# Altium schematic sheet FPGAPowerSupply.SchDoc
size A4
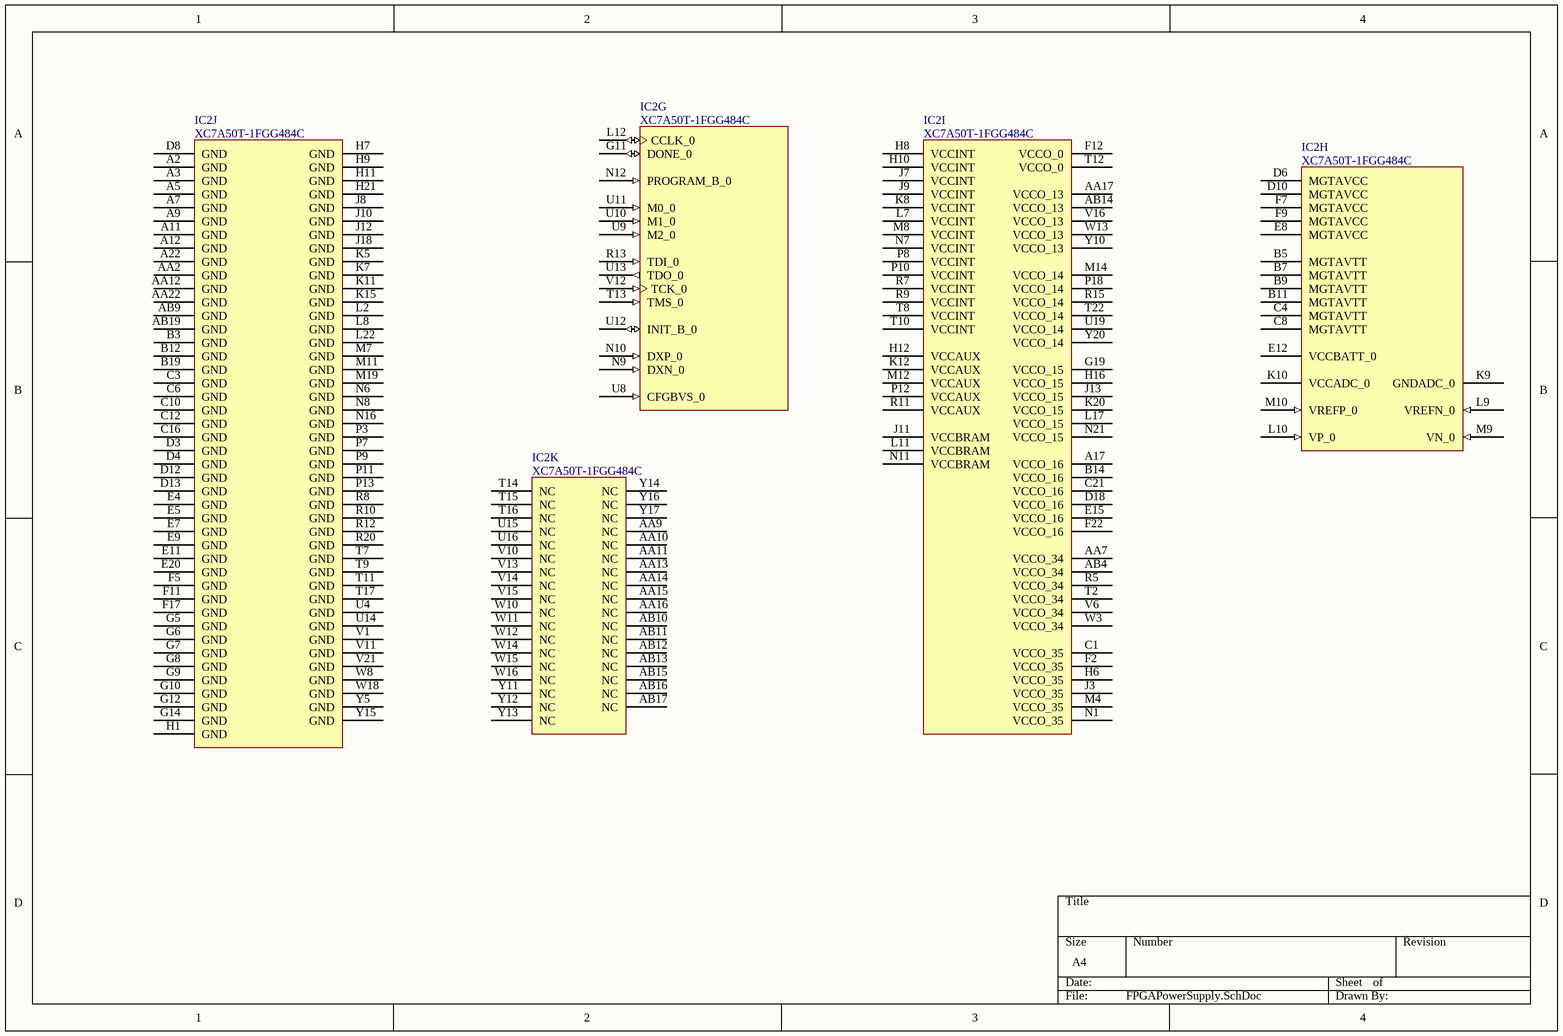
[diagram p0: FPGAPowerSupply.SchDoc]

## Parts
IC2  XC7A50T-1FGG484C  [BGA484C100P22X22_2300X2300X260]  (parts G,H,I,J,K of 11)

## Nets

Not connected (* = marked no-connect by the designer): IC2 A2(GND) A3(GND) A5(GND) A7(GND) A9(GND) A11(GND) A12(GND) A17(VCCO_16) A22(GND) AA2(GND) AA7(VCCO_34) AA9(NC) AA10(NC) AA11(NC) AA12(GND) AA13(NC) AA14(NC) AA15(NC) AA16(NC) AA17(VCCO_13) AA22(GND) AB4(VCCO_34) AB9(GND) AB10(NC) AB11(NC) AB12(NC) AB13(NC) AB14(VCCO_13) AB15(NC) AB16(NC) AB17(NC) AB19(GND) B3(GND) B5(MGTAVTT) B7(MGTAVTT) B9(MGTAVTT) B11(MGTAVTT) B12(GND) B14(VCCO_16) B19(GND) C1(VCCO_35) C3(GND) C4(MGTAVTT) C6(GND) C8(MGTAVTT) C10(GND) C12(GND) C16(GND) C21(VCCO_16) D3(GND) D4(GND) D6(MGTAVCC) D8(GND) D10(MGTAVCC) D12(GND) D13(GND) D18(VCCO_16) E4(GND) E5(GND) E7(GND) E8(MGTAVCC) E9(GND) E11(GND) E12(VCCBATT_0) E15(VCCO_16) E20(GND) F2(VCCO_35) F5(GND) F7(MGTAVCC) F9(MGTAVCC) F11(GND) F12(VCCO_0) F17(GND) F22(VCCO_16) G5(GND) G6(GND) G7(GND) G8(GND) G9(GND) G10(GND) G11(DONE_0) G12(GND) G14(GND) G19(VCCO_15) H1(GND) H6(VCCO_35) H7(GND) H8(VCCINT) H9(GND) H10(VCCINT) H11(GND) H12(VCCAUX) H16(VCCO_15) H21(GND) J3(VCCO_35) J7(VCCINT) J8(GND) J9(VCCINT) J10(GND) J11(VCCBRAM) J12(GND) J13(VCCO_15) J18(GND) K5(GND) K7(GND) K8(VCCINT) K9(GNDADC_0) K10(VCCADC_0) K11(GND) K12(VCCAUX) K15(GND) K20(VCCO_15) L2(GND) L7(VCCINT) L8(GND) L9(VREFN_0) L10(VP_0) L11(VCCBRAM) L12(CCLK_0) L17(VCCO_15) L22(GND) M4(VCCO_35) M7(GND) M8(VCCINT) M9(VN_0) M10(VREFP_0) M11(GND) M12(VCCAUX) M14(VCCO_14) M19(GND) N1(VCCO_35) N6(GND) N7(VCCINT) N8(GND) N9(DXN_0) N10(DXP_0) N11(VCCBRAM) N12(PROGRAM_B_0) N16(GND) N21(VCCO_15) P3(GND) P7(GND) P8(VCCINT) P9(GND) P10(VCCINT) P11(GND) P12(VCCAUX) P13(GND) P18(VCCO_14) R5(VCCO_34) R7(VCCINT) R8(GND) R9(VCCINT) R10(GND) R11(VCCAUX) R12(GND) R13(TDI_0) R15(VCCO_14) R20(GND) T2(VCCO_34) T7(GND) T8(VCCINT) T9(GND) T10(VCCINT) T11(GND) T12(VCCO_0) T13(TMS_0) T14(NC) T15(NC) T16(NC) T17(GND) T22(VCCO_14) U4(GND) U8(CFGBVS_0) U9(M2_0) U10(M1_0) U11(M0_0) U12(INIT_B_0) U13(TDO_0) U14(GND) U15(NC) U16(NC) U19(VCCO_14) V1(GND) V6(VCCO_34) V10(NC) V11(GND) V12(TCK_0) V13(NC) V14(NC) V15(NC) V16(VCCO_13) V21(GND) W3(VCCO_34) W8(GND) W10(NC) W11(NC) W12(NC) W13(VCCO_13) W14(NC) W15(NC) W16(NC) W18(GND) Y5(GND) Y10(VCCO_13) Y11(NC) Y12(NC) Y13(NC) Y14(NC) Y15(GND) Y16(NC) Y17(NC) Y20(VCCO_14)

## Library data of the parts
IC2 = XC7A50T-1FGG484C: Artix-7 FPGA, 4 GTPs, 250 User I/Os, 484-Ball Fine-Pitch Thin BGA (1.0mm Pitch), Speed Grade 1, Commercial Grade, Pb-Free; Manufacturer: XILINX; PressFit: No; Bonding: No; Part Number: XC7A50T-1FGG484C; Component Kind: Standard; Component Type: Standard; Device: XC7A50T-1FGG484C; PackageDescription: BGA, 1.00mm Pitch, Square; 484 Pin, 22 Columns x 22 Rows, Body 23mm X 23mm X 2.60mm H, IPC Medium Density; Part Description: Artix-7 FPGA, 4 GTPs, 250 User I/Os, 484-Ball Fine-Pitch Thin BGA (1.0mm Pitch), Speed Grade 1, Commercial Grade, Pb-Free; Manufacturer Part Number: XC7A50T-1FGG484C; Pin Count: 484; Case: BGA484; Mounted: Yes; Socket: No; SMD: Yes; Sense: No; ComponentHeight: 2.6mm; HelpURL: \\cern.ch\dfs\Applications\Altium\Datasheets\XC7A50T-1FGG484C.pdf; ComponentLink1URL: \\cern.ch\dfs\Applications\Altium\Datasheets\XC7A50T-1FGG484C_Package-Pinout.pdf; ComponentLink1Description: Package/Pinout; Author: CERN DEM BC; CreateDate: 27.07.2015; LatestRevisionDate: 27.07.2015